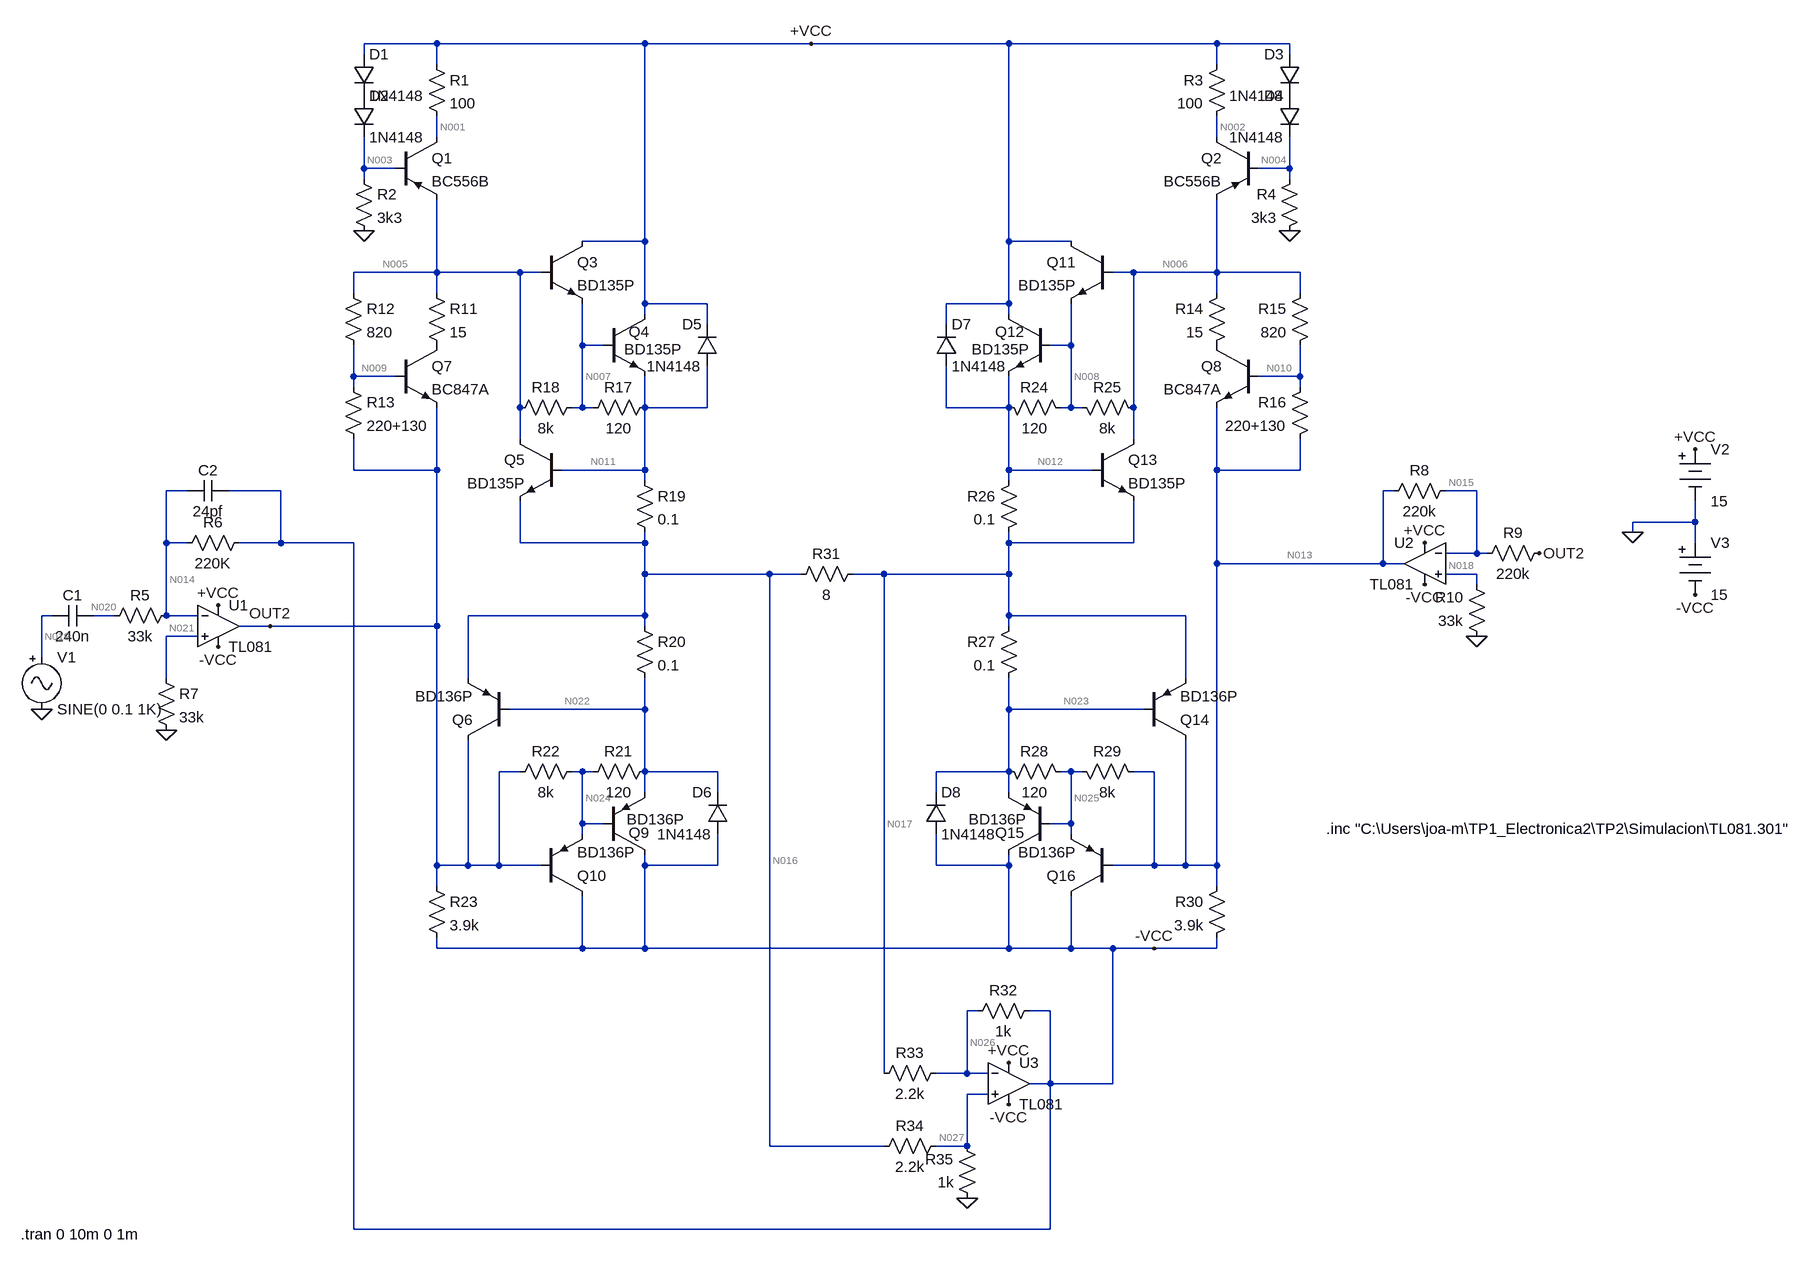
[diagram p0: schematic Amplificador.asc]
Amplificador.asc, the LTspice schematic file:
Version 4
SHEET 1 1564 1720
WIRE -608 -128 -720 -128
WIRE -288 -128 -608 -128
WIRE -32 -128 -288 -128
WIRE 272 -128 -32 -128
WIRE 592 -128 272 -128
WIRE 704 -128 592 -128
WIRE -720 -112 -720 -128
WIRE 704 -112 704 -128
WIRE -608 -96 -608 -128
WIRE 592 -96 592 -128
WIRE -608 16 -608 -16
WIRE 592 16 592 -16
WIRE -720 64 -720 16
WIRE -672 64 -720 64
WIRE 704 64 704 16
WIRE 704 64 656 64
WIRE -720 80 -720 64
WIRE 704 80 704 64
WIRE -288 176 -288 -128
WIRE -288 176 -384 176
WIRE 272 176 272 -128
WIRE 368 176 272 176
WIRE -608 224 -608 112
WIRE -608 224 -736 224
WIRE -480 224 -608 224
WIRE -448 224 -480 224
WIRE 464 224 432 224
WIRE 592 224 592 112
WIRE 592 224 464 224
WIRE 720 224 592 224
WIRE -736 256 -736 224
WIRE -608 256 -608 224
WIRE 592 256 592 224
WIRE 720 256 720 224
WIRE -288 272 -288 176
WIRE -192 272 -288 272
WIRE 272 272 272 176
WIRE 272 272 176 272
WIRE -288 288 -288 272
WIRE 272 288 272 272
WIRE -192 304 -192 272
WIRE 176 304 176 272
WIRE -384 336 -384 272
WIRE -352 336 -384 336
WIRE 368 336 368 272
WIRE 368 336 336 336
WIRE -736 384 -736 336
WIRE -672 384 -736 384
WIRE 720 384 720 336
WIRE 720 384 656 384
WIRE -736 400 -736 384
WIRE 720 400 720 384
WIRE -480 432 -480 224
WIRE -384 432 -384 336
WIRE -384 432 -400 432
WIRE -368 432 -384 432
WIRE -288 432 -288 384
WIRE -192 432 -192 368
WIRE -192 432 -288 432
WIRE 176 432 176 368
WIRE 272 432 272 384
WIRE 272 432 176 432
WIRE 368 432 368 336
WIRE 368 432 352 432
WIRE 384 432 368 432
WIRE 464 432 464 224
WIRE -480 480 -480 432
WIRE 464 480 464 432
WIRE -736 528 -736 480
WIRE -608 528 -608 432
WIRE -608 528 -736 528
WIRE -288 528 -288 432
WIRE -288 528 -416 528
WIRE 272 528 272 432
WIRE 400 528 272 528
WIRE 592 528 592 432
WIRE 720 528 720 480
WIRE 720 528 592 528
WIRE -288 544 -288 528
WIRE 272 544 272 528
WIRE -992 560 -1024 560
WIRE -848 560 -928 560
WIRE 864 560 848 560
WIRE 992 560 944 560
WIRE 1328 608 1328 576
WIRE 1328 608 1232 608
WIRE 1232 624 1232 608
WIRE -1024 640 -1024 560
WIRE -992 640 -1024 640
WIRE -848 640 -848 560
WIRE -848 640 -912 640
WIRE -736 640 -848 640
WIRE -480 640 -480 576
WIRE -288 640 -288 624
WIRE -288 640 -480 640
WIRE 272 640 272 624
WIRE 464 640 464 576
WIRE 464 640 272 640
WIRE 1328 640 1328 608
WIRE 992 656 992 560
WIRE 992 656 944 656
WIRE 1008 656 992 656
WIRE 592 672 592 528
WIRE 848 672 848 560
WIRE 848 672 592 672
WIRE 880 672 848 672
WIRE -288 688 -288 640
WIRE -96 688 -288 688
WIRE -48 688 -96 688
WIRE 80 688 32 688
WIRE 272 688 272 640
WIRE 272 688 80 688
WIRE 992 688 944 688
WIRE 992 704 992 688
WIRE -1200 752 -1216 752
WIRE -1104 752 -1136 752
WIRE -1024 752 -1024 640
WIRE -976 752 -1024 752
WIRE -288 752 -288 688
WIRE -288 752 -560 752
WIRE 272 752 272 688
WIRE 544 752 272 752
WIRE -864 768 -912 768
WIRE -608 768 -608 528
WIRE -608 768 -864 768
WIRE -288 768 -288 752
WIRE 272 768 272 752
WIRE -976 784 -1024 784
WIRE -1216 816 -1216 752
WIRE -1024 848 -1024 784
WIRE -560 848 -560 752
WIRE 544 848 544 752
WIRE -288 896 -288 848
WIRE -288 896 -496 896
WIRE 272 896 272 848
WIRE 480 896 272 896
WIRE -480 992 -512 992
WIRE -384 992 -400 992
WIRE -368 992 -384 992
WIRE -288 992 -288 896
WIRE -176 992 -288 992
WIRE 272 992 272 896
WIRE 272 992 160 992
WIRE 368 992 352 992
WIRE 384 992 368 992
WIRE 496 992 464 992
WIRE -288 1024 -288 992
WIRE -176 1024 -176 992
WIRE 160 1024 160 992
WIRE 272 1024 272 992
WIRE -384 1072 -384 992
WIRE -352 1072 -384 1072
WIRE 368 1072 368 992
WIRE 368 1072 336 1072
WIRE -384 1088 -384 1072
WIRE 368 1088 368 1072
WIRE -608 1136 -608 768
WIRE -560 1136 -560 944
WIRE -560 1136 -608 1136
WIRE -512 1136 -512 992
WIRE -512 1136 -560 1136
WIRE -448 1136 -512 1136
WIRE -288 1136 -288 1120
WIRE -176 1136 -176 1088
WIRE -176 1136 -288 1136
WIRE 160 1136 160 1088
WIRE 272 1136 272 1120
WIRE 272 1136 160 1136
WIRE 496 1136 496 992
WIRE 496 1136 432 1136
WIRE 544 1136 544 944
WIRE 544 1136 496 1136
WIRE 592 1136 592 672
WIRE 592 1136 544 1136
WIRE -608 1168 -608 1136
WIRE 592 1168 592 1136
WIRE -608 1264 -608 1248
WIRE -384 1264 -384 1184
WIRE -384 1264 -608 1264
WIRE -288 1264 -288 1136
WIRE -288 1264 -384 1264
WIRE 272 1264 272 1136
WIRE 272 1264 -288 1264
WIRE 368 1264 368 1184
WIRE 368 1264 272 1264
WIRE 432 1264 368 1264
WIRE 496 1264 432 1264
WIRE 592 1264 592 1248
WIRE 592 1264 496 1264
WIRE 224 1360 208 1360
WIRE 336 1360 304 1360
WIRE 80 1456 80 688
WIRE 208 1456 208 1360
WIRE 208 1456 160 1456
WIRE 240 1456 208 1456
WIRE 336 1472 336 1360
WIRE 336 1472 304 1472
WIRE 432 1472 432 1264
WIRE 432 1472 336 1472
WIRE 240 1488 208 1488
WIRE -96 1568 -96 688
WIRE 80 1568 -96 1568
WIRE 208 1568 208 1488
WIRE 208 1568 160 1568
WIRE -736 1696 -736 640
WIRE 336 1696 336 1472
WIRE 336 1696 -736 1696
FLAG -720 160 0
FLAG -1216 896 0
FLAG -1024 928 0
FLAG 992 784 0
FLAG -864 768 OUT2
FLAG 1088 656 OUT2
FLAG 704 160 0
FLAG 208 1648 0
FLAG 1232 624 0
FLAG 1328 496 +VCC
FLAG 1328 720 -VCC
FLAG -944 736 +VCC
FLAG 912 640 +VCC
FLAG 272 1440 +VCC
FLAG -944 800 -VCC
FLAG 272 1504 -VCC
FLAG 912 704 -VCC
FLAG -32 -128 +VCC
FLAG 496 1264 -VCC
SYMBOL pnp -672 16 R0
SYMATTR InstName Q1
SYMATTR Value BC556B
SYMBOL diode -736 -112 R0
SYMATTR InstName D1
SYMATTR Value 1N4148
SYMBOL diode -736 -48 R0
SYMATTR InstName D2
SYMATTR Value 1N4148
SYMBOL res -624 -112 R0
SYMATTR InstName R1
SYMATTR Value 100
SYMBOL res -736 64 R0
SYMATTR InstName R2
SYMATTR Value 3k3
SYMBOL Opamps\\opamp2 -944 704 R0
SYMATTR InstName U1
SYMATTR Value TL081
SYMATTR SpiceModel TL081
SYMBOL Opamps\\opamp2 912 608 M0
SYMATTR InstName U2
SYMATTR Value TL081
SYMATTR SpiceModel TL081
SYMBOL Misc\\signal -1216 800 R0
WINDOW 123 0 0 Left 0
WINDOW 39 0 0 Left 0
SYMATTR InstName V1
SYMATTR Value SINE(0 0.1 1K)
SYMBOL cap -1136 736 R90
WINDOW 0 0 32 VBottom 2
WINDOW 3 32 32 VTop 2
SYMATTR InstName C1
SYMATTR Value 240n
SYMBOL res -1008 736 R90
WINDOW 0 0 56 VBottom 2
WINDOW 3 32 56 VTop 2
SYMATTR InstName R5
SYMATTR Value 33k
SYMBOL res -896 624 R90
WINDOW 0 0 56 VBottom 2
WINDOW 3 32 56 VTop 2
SYMATTR InstName R6
SYMATTR Value 220K
SYMBOL cap -928 544 R90
WINDOW 0 0 32 VBottom 2
WINDOW 3 32 32 VTop 2
SYMATTR InstName C2
SYMATTR Value 24pf
SYMBOL res -1040 832 R0
SYMATTR InstName R7
SYMATTR Value 33k
SYMBOL res 960 544 R90
WINDOW 0 0 56 VBottom 2
WINDOW 3 32 56 VTop 2
SYMATTR InstName R8
SYMATTR Value 220k
SYMBOL res 1104 640 R90
WINDOW 0 0 56 VBottom 2
WINDOW 3 32 56 VTop 2
SYMATTR InstName R9
SYMATTR Value 220k
SYMBOL res 1008 800 R180
WINDOW 0 36 76 Left 2
WINDOW 3 36 40 Left 2
SYMATTR InstName R10
SYMATTR Value 33k
SYMBOL npn -672 336 R0
SYMATTR InstName Q7
SYMATTR Value BC847A
SYMBOL res -624 240 R0
SYMATTR InstName R11
SYMATTR Value 15
SYMBOL res -752 240 R0
SYMATTR InstName R12
SYMATTR Value 820
SYMBOL res -752 384 R0
SYMATTR InstName R13
SYMATTR Value 220+130
SYMBOL npn -448 176 R0
SYMATTR InstName Q3
SYMATTR Value BD135P
SYMBOL npn -352 288 R0
WINDOW 0 39 27 Left 2
WINDOW 3 32 54 Left 2
SYMATTR InstName Q4
SYMATTR Value BD135P
SYMBOL diode -176 368 R180
WINDOW 0 24 64 Left 2
WINDOW 3 24 0 Left 2
SYMATTR InstName D5
SYMATTR Value 1N4148
SYMBOL res -272 416 R90
WINDOW 0 0 56 VBottom 2
WINDOW 3 32 56 VTop 2
SYMATTR InstName R17
SYMATTR Value 120
SYMBOL res -384 416 R90
WINDOW 0 0 56 VBottom 2
WINDOW 3 32 56 VTop 2
SYMATTR InstName R18
SYMATTR Value 8k
SYMBOL npn -416 480 M0
SYMATTR InstName Q5
SYMATTR Value BD135P
SYMBOL res -304 528 R0
SYMATTR InstName R19
SYMATTR Value 0.1
SYMBOL res -304 752 R0
SYMATTR InstName R20
SYMATTR Value 0.1
SYMBOL pnp -496 944 R180
SYMATTR InstName Q6
SYMATTR Value BD136P
SYMBOL pnp -352 1120 M180
WINDOW 0 39 34 Left 2
WINDOW 3 36 55 Left 2
SYMATTR InstName Q9
SYMATTR Value BD136P
SYMBOL pnp -448 1184 M180
SYMATTR InstName Q10
SYMATTR Value BD136P
SYMBOL res -272 976 R90
WINDOW 0 0 56 VBottom 2
WINDOW 3 32 56 VTop 2
SYMATTR InstName R21
SYMATTR Value 120
SYMBOL res -384 976 R90
WINDOW 0 0 56 VBottom 2
WINDOW 3 32 56 VTop 2
SYMATTR InstName R22
SYMATTR Value 8k
SYMBOL diode -160 1088 R180
WINDOW 0 24 64 Left 2
WINDOW 3 24 0 Left 2
SYMATTR InstName D6
SYMATTR Value 1N4148
SYMBOL res -624 1152 R0
SYMATTR InstName R23
SYMATTR Value 3.9k
SYMBOL pnp 656 16 M0
SYMATTR InstName Q2
SYMATTR Value BC556B
SYMBOL diode 720 -112 M0
SYMATTR InstName D3
SYMATTR Value 1N4148
SYMBOL diode 720 -48 M0
SYMATTR InstName D4
SYMATTR Value 1N4148
SYMBOL res 608 -112 M0
SYMATTR InstName R3
SYMATTR Value 100
SYMBOL res 720 64 M0
SYMATTR InstName R4
SYMATTR Value 3k3
SYMBOL npn 656 336 M0
SYMATTR InstName Q8
SYMATTR Value BC847A
SYMBOL res 608 240 M0
SYMATTR InstName R14
SYMATTR Value 15
SYMBOL res 736 240 M0
SYMATTR InstName R15
SYMATTR Value 820
SYMBOL res 736 384 M0
SYMATTR InstName R16
SYMATTR Value 220+130
SYMBOL npn 432 176 M0
SYMATTR InstName Q11
SYMATTR Value BD135P
SYMBOL npn 336 288 M0
WINDOW 0 39 27 Left 2
WINDOW 3 32 54 Left 2
SYMATTR InstName Q12
SYMATTR Value BD135P
SYMBOL diode 160 368 M180
WINDOW 0 24 64 Left 2
WINDOW 3 24 0 Left 2
SYMATTR InstName D7
SYMATTR Value 1N4148
SYMBOL res 256 416 M90
WINDOW 0 0 56 VBottom 2
WINDOW 3 32 56 VTop 2
SYMATTR InstName R24
SYMATTR Value 120
SYMBOL res 368 416 M90
WINDOW 0 0 56 VBottom 2
WINDOW 3 32 56 VTop 2
SYMATTR InstName R25
SYMATTR Value 8k
SYMBOL npn 400 480 R0
SYMATTR InstName Q13
SYMATTR Value BD135P
SYMBOL res 288 528 M0
SYMATTR InstName R26
SYMATTR Value 0.1
SYMBOL res 288 752 M0
SYMATTR InstName R27
SYMATTR Value 0.1
SYMBOL pnp 480 944 M180
SYMATTR InstName Q14
SYMATTR Value BD136P
SYMBOL pnp 336 1120 R180
WINDOW 0 39 34 Left 2
WINDOW 3 36 55 Left 2
SYMATTR InstName Q15
SYMATTR Value BD136P
SYMBOL pnp 432 1184 R180
SYMATTR InstName Q16
SYMATTR Value BD136P
SYMBOL res 256 976 M90
WINDOW 0 0 56 VBottom 2
WINDOW 3 32 56 VTop 2
SYMATTR InstName R28
SYMATTR Value 120
SYMBOL res 368 976 M90
WINDOW 0 0 56 VBottom 2
WINDOW 3 32 56 VTop 2
SYMATTR InstName R29
SYMATTR Value 8k
SYMBOL diode 144 1088 M180
WINDOW 0 24 64 Left 2
WINDOW 3 24 0 Left 2
SYMATTR InstName D8
SYMATTR Value 1N4148
SYMBOL res 608 1152 M0
SYMATTR InstName R30
SYMATTR Value 3.9k
SYMBOL res 48 672 R90
WINDOW 0 0 56 VBottom 2
WINDOW 3 32 56 VTop 2
SYMATTR InstName R31
SYMATTR Value 8
SYMBOL Opamps\\opamp2 272 1408 R0
SYMATTR InstName U3
SYMATTR Value TL081
SYMATTR SpiceModel TL081
SYMBOL res 320 1344 R90
WINDOW 0 0 56 VBottom 2
WINDOW 3 32 56 VTop 2
SYMATTR InstName R32
SYMATTR Value 1k
SYMBOL res 176 1440 R90
WINDOW 0 0 56 VBottom 2
WINDOW 3 32 56 VTop 2
SYMATTR InstName R33
SYMATTR Value 2.2k
SYMBOL res 176 1552 R90
WINDOW 0 0 56 VBottom 2
WINDOW 3 32 56 VTop 2
SYMATTR InstName R34
SYMATTR Value 2.2k
SYMBOL res 224 1664 R180
WINDOW 0 36 76 Left 2
WINDOW 3 36 40 Left 2
SYMATTR InstName R35
SYMATTR Value 1k
SYMBOL Misc\\battery 1328 480 R0
WINDOW 123 0 0 Left 0
WINDOW 39 0 0 Left 0
SYMATTR InstName V2
SYMATTR Value 15
SYMBOL Misc\\battery 1328 624 R0
WINDOW 123 0 0 Left 0
WINDOW 39 0 0 Left 0
SYMATTR InstName V3
SYMATTR Value 15
TEXT -1248 1704 Left 2 !.tran 0 10m 0 1m
TEXT 760 1080 Left 2 !.inc "C:\\Users\\joa-m\\TP1_Electronica2\\TP2\\Simulacion\\TL081.301"

The netlist it stands for:
* Amplificador.asc
Q1 N001 N003 N005 0 BC556B
D1 +VCC P001 1N4148
D2 P001 N003 1N4148
R1 +VCC N001 100
R2 N003 0 3k3
XU1 N021 N014 +VCC -VCC OUT2 TL081 TL081  ; pins In+ In- V+ V- OUT
XU2 N018 N015 +VCC -VCC N013 TL081 TL081  ; pins In+ In- V+ V- OUT
V1 N019 0 SINE(0 0.1 1K)
C1 N020 N019 240n
R5 N014 N020 33k
R6 -VCC N014 220K
C2 -VCC N014 24pf
R7 N021 0 33k
R8 N015 N013 220k
R9 OUT2 N015 220k
R10 0 N018 33k
Q7 P002 N009 OUT2 0 BC847A
R11 N005 P002 15
R12 N005 N009 820
R13 N009 OUT2 220+130
Q3 +VCC N005 N007 0 BD135P
Q4 +VCC N007 N011 0 BD135P
D5 N011 +VCC 1N4148
R17 N011 N007 120
R18 N007 N005 8k
Q5 N005 N011 N016 0 BD135P
R19 N011 N016 0.1
R20 N016 N022 0.1
Q6 OUT2 N022 N016 0 BD136P
Q9 -VCC N024 N022 0 BD136P
Q10 -VCC OUT2 N024 0 BD136P
R21 N022 N024 120
R22 N024 OUT2 8k
D6 -VCC N022 1N4148
R23 OUT2 -VCC 3.9k
Q2 N002 N004 N006 0 BC556B
D3 +VCC P003 1N4148
D4 P003 N004 1N4148
R3 +VCC N002 100
R4 N004 0 3k3
Q8 P004 N010 N013 0 BC847A
R14 N006 P004 15
R15 N006 N010 820
R16 N010 N013 220+130
Q11 +VCC N006 N008 0 BD135P
Q12 +VCC N008 N012 0 BD135P
D7 N012 +VCC 1N4148
R24 N012 N008 120
R25 N008 N006 8k
Q13 N006 N012 N017 0 BD135P
R26 N012 N017 0.1
R27 N017 N023 0.1
Q14 N013 N023 N017 0 BD136P
Q15 -VCC N025 N023 0 BD136P
Q16 -VCC N013 N025 0 BD136P
R28 N023 N025 120
R29 N025 N013 8k
D8 -VCC N023 1N4148
R30 N013 -VCC 3.9k
R31 N017 N016 8
XU3 N027 N026 +VCC -VCC -VCC TL081 TL081  ; pins In+ In- V+ V- OUT
R32 -VCC N026 1k
R33 N026 N017 2.2k
R34 N027 N016 2.2k
R35 0 N027 1k
V2 +VCC 0 15
V3 0 -VCC 15
.model D D
.lib standard.dio
.model NPN NPN
.model PNP PNP
.lib standard.bjt
.tran 0 10m 0 1m
.inc "C:\Users\joa-m\TP1_Electronica2\TP2\Simulacion\TL081.301"
.backanno
.end

* Results of the author's LTspice run, read from the files saved beside the schematic
* Operating Point, zero values left out:
*   V(n001) = 14.5 V
*   V(n003) = 13.79 V
*   V(n005) = 14.5 V
*   V(+vcc) = 15 V
*   V(p001) = 14.39 V
*   V(out2) = 12.86 V
*   V(-vcc) = -15 V
*   V(n014) = -14.26 V
*   V(n021) = -1.945 µV
*   V(n013) = -12.86 V
*   V(n015) = 76.65 µV
*   V(n018) = -1.487 µV
*   V(n020) = -14.26 V
*   V(p002) = 14.5 V
*   V(n009) = 13.08 V
*   V(n007) = 13.77 V
*   V(n011) = 12.45 V
*   V(n016) = 12.18 V
*   V(n022) = 12.18 V
*   V(n024) = 12.19 V
*   V(n002) = 14.37 V
*   V(n004) = 13.71 V
*   V(n006) = -8.15 V
*   V(p003) = 14.35 V
*   V(p004) = -8.161 V
*   V(n010) = -12.21 V
*   V(n008) = -8.832 V
*   V(n012) = -9.778 V
*   V(n017) = -9.87 V
*   V(n023) = -10.24 V
*   V(n025) = -12.02 V
*   V(n026) = -13.4 V
*   V(n027) = 3.806 V
*   Ic(Q16) = -287.1 mA
*   Ib(Q16) = -3.161 mA
*   Ie(Q16) = 290.2 mA
*   Ic(Q15) = -3.385 A
*   Ib(Q15) = -275.5 mA
*   Ie(Q15) = 3.66 A
*   Ic(Q14) = -119.9 nA
*   Ib(Q14) = -648.2 pA
*   Ie(Q14) = 120.5 nA
*   Ic(Q10) = -27.84 pA
*   Ib(Q10) = 28.55 pA
*   Ic(Q9) = -27.32 pA
*   Ib(Q9) = 27.22 pA
*   Ic(Q6) = 20.12 mA
*   Ib(Q6) = -1.841 mA
*   Ie(Q6) = -18.28 mA
*   Ic(Q13) = 3.534 pA
*   Ib(Q13) = -1.542 pA
*   Ie(Q13) = -1.992 pA
*   Ic(Q12) = 902.9 mA
*   Ib(Q12) = 10.04 mA
*   Ie(Q12) = -912.9 mA
*   Ic(Q11) = 17.7 mA
*   Ib(Q11) = 131.6 µA
*   Ie(Q11) = -17.84 mA
*   Ic(Q5) = 2.157 nA
*   Ib(Q5) = 25.75 pA
*   Ie(Q5) = -2.182 nA
*   Ic(Q4) = 2.671 A
*   Ib(Q4) = 57.95 mA
*   Ie(Q4) = -2.729 A
*   Ic(Q3) = 68.24 mA
*   Ib(Q3) = 577.3 µA
*   Ie(Q3) = -68.81 mA
*   Ic(Q8) = 745.3 µA
*   Ib(Q8) = 4.085 µA
*   Ie(Q8) = -749.4 µA
*   Ic(Q7) = 67.1 pA
*   Ib(Q7) = -5.687 pA
*   Ie(Q7) = -61.41 pA
*   Ic(Q2) = 6.303 mA
*   Ib(Q2) = -384.1 µA
*   Ie(Q2) = -5.919 mA
*   Ic(Q1) = 4.97 mA
*   Ib(Q1) = -2.577 mA
*   Ie(Q1) = -2.393 mA
*   I(D8) = -2.525 nA
*   I(D7) = -2.545 nA
*   I(D4) = 3.77 mA
*   I(D3) = 3.77 mA
*   I(D6) = -2.547 nA
*   I(D5) = -2.523 nA
*   I(D2) = 1.601 mA
*   I(D1) = 1.601 mA
*   I(R35) = -3.806 mA
*   I(R34) = -3.806 mA
*   I(R33) = -1.603 mA
*   I(R32) = -1.603 mA
*   I(R31) = -2.756 A
*   I(R30) = 549.2 µA
*   I(R29) = 104.2 µA
*   I(R28) = 14.89 mA
*   I(R27) = 3.675 A
*   I(R26) = 920.8 mA
*   I(R25) = -85.33 µA
*   I(R24) = -7.885 mA
*   I(R16) = 4.953 mA
*   I(R15) = 4.957 mA
*   I(R14) = 745.3 µA
*   I(R4) = 4.154 mA
*   I(R3) = 6.303 mA
*   I(R23) = 7.143 mA
*   I(R22) = -83.63 µA
*   I(R21) = -83.63 µA
*   I(R20) = -1.925 mA
*   I(R19) = 2.74 A
*   I(R18) = -91.14 µA
*   I(R17) = -10.96 mA
*   I(R13) = 1.725 mA
*   I(R12) = 1.725 mA
*   I(R11) = 67.1 pA
*   I(R10) = 45.05 pA
*   I(R9) = 58.45 µA
*   I(R8) = 58.45 µA
*   I(R7) = -58.94 pA
*   I(R6) = -3.348 µA
*   I(R2) = 4.178 mA
*   I(R1) = 4.97 mA
*   I(V3) = -3.751 A
*   I(V2) = -3.719 A
*   Ix(u1:1) = 58.94 pA
*   Ix(u1:2) = -3.348 µA
*   Ix(u1:3) = 14.19 mA
*   Ix(u1:4) = -14.2 mA
*   Ix(u1:5) = -25.68 mA
*   Ix(u2:1) = 45.05 pA
*   Ix(u2:2) = 45.05 pA
*   Ix(u2:3) = 14.19 mA
*   Ix(u2:4) = -14.19 mA
*   Ix(u2:5) = 8.477 mA
*   Ix(u3:1) = 66.12 pA
*   Ix(u3:2) = 30.78 pA
*   Ix(u3:3) = 14.19 mA
*   Ix(u3:4) = 706.6 GA
*   Ix(u3:5) = -706.6 GA
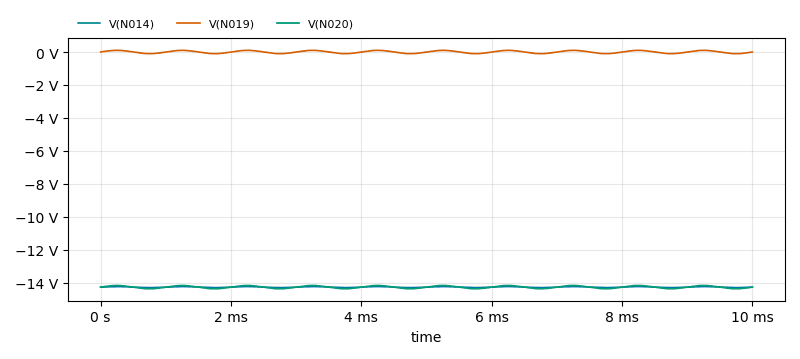
[diagram p1: Transient Analysis of Amplificador.asc, plotted from the saved traces]
* Transient Analysis, 1 run:
*   V(N014): min -14.29 V, max -14.23 V, average -14.26 V, rms 14.26 V, last -14.26 V
*   V(N019): min -99.95 mV, max 99.95 mV, average 3.135 µV, rms 71.84 mV, last 0 V
*   V(N020): min -14.36 V, max -14.16 V, average -14.26 V, rms 14.26 V, last -14.26 V